# EAGLE design AST1013 (EAGLE 6.3)
DATABASE: ./../../../../../Components/TinyCircuits_Part_Database.txt
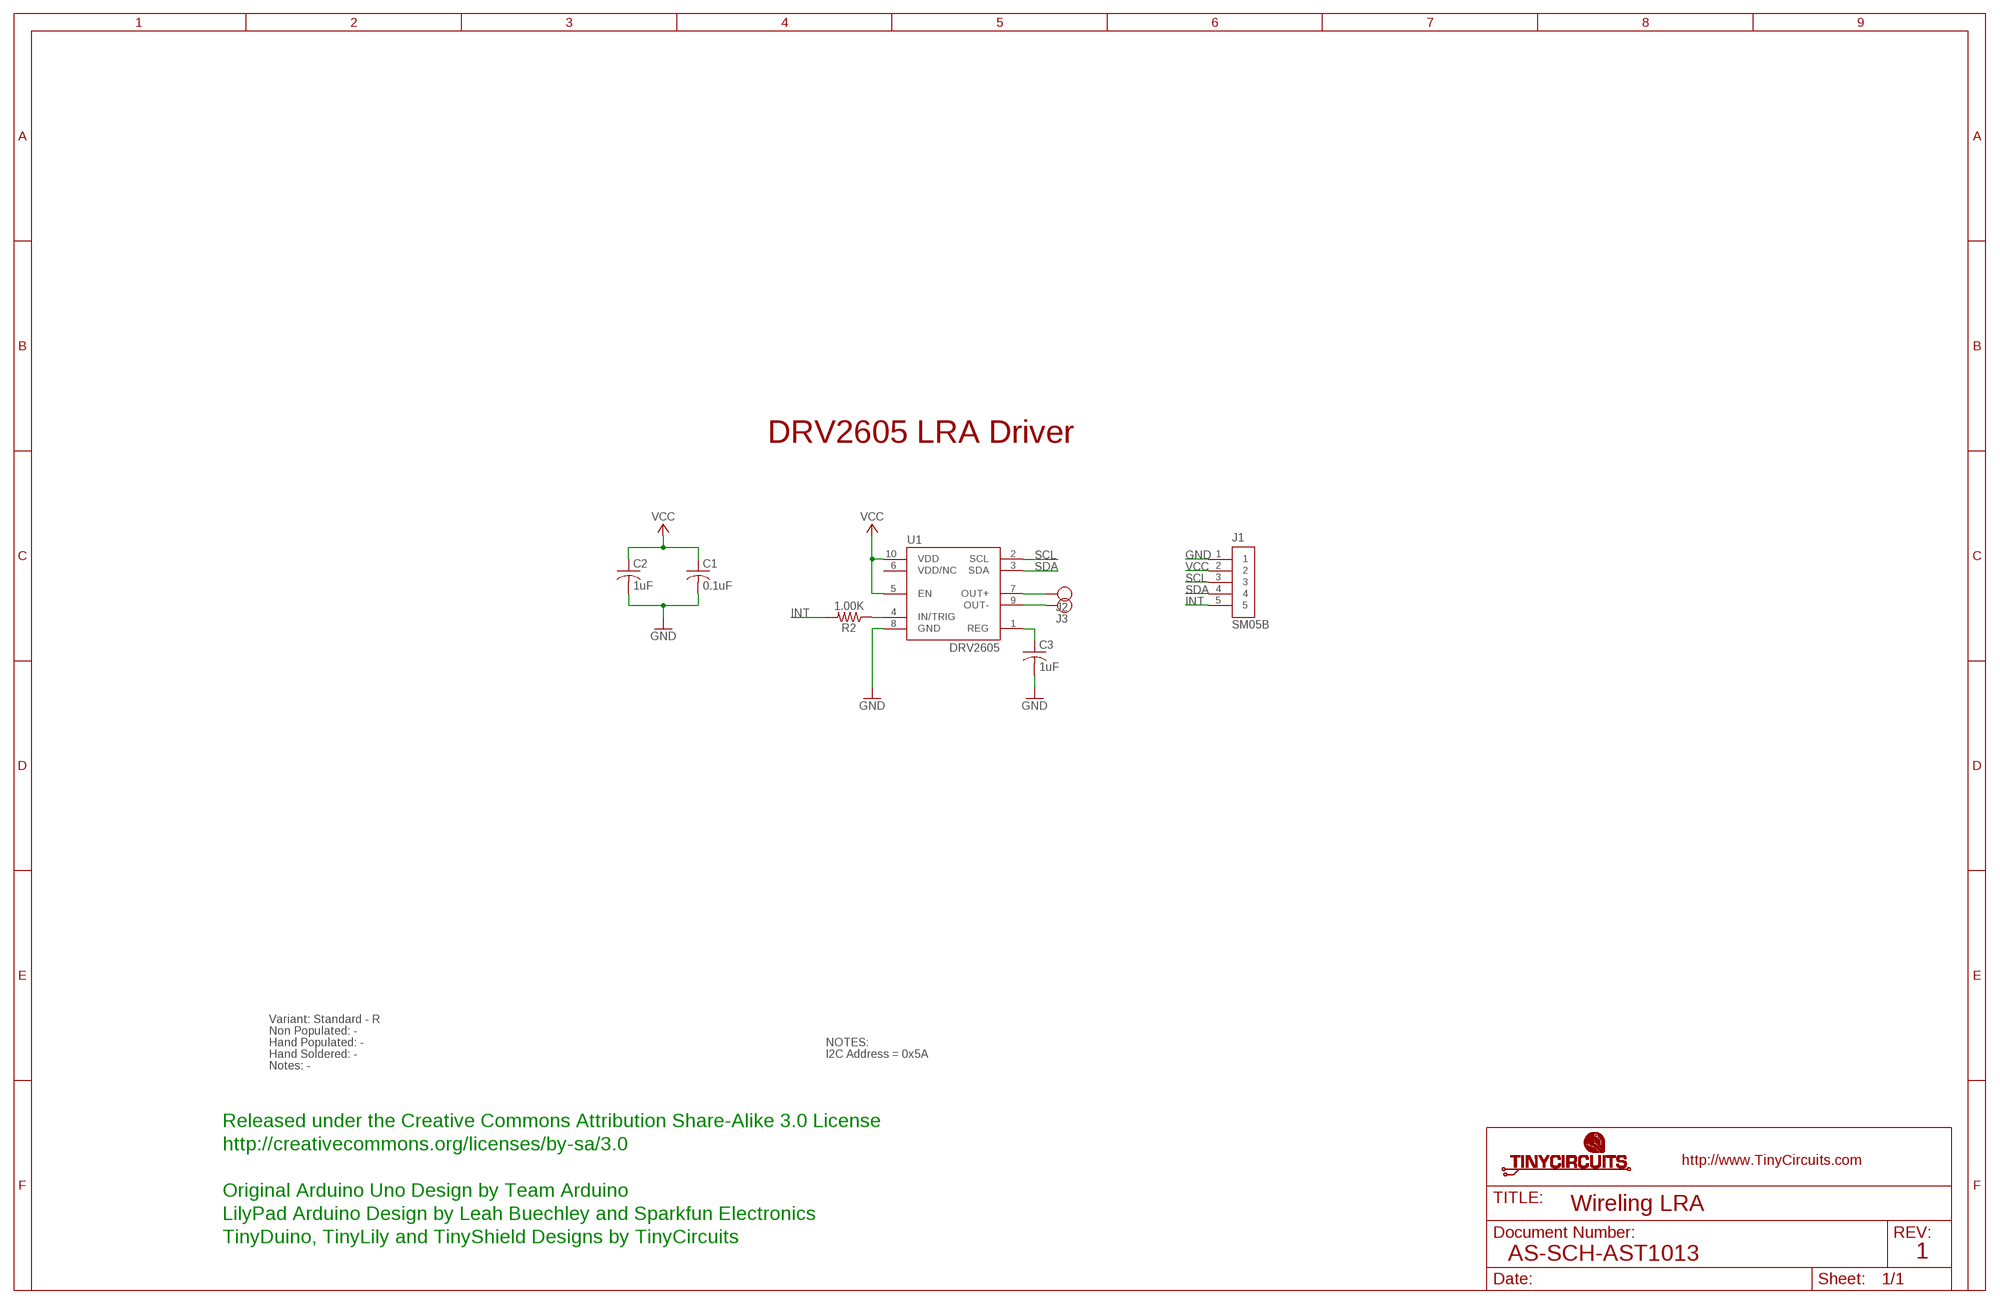
[diagram p0: schematic, sheet 1]

## Parts
C1  0.1uF  AS-ITM-00008  [C0402]
C2  1uF  AS-ITM-00410  [C0603]
C3  1uF  AS-ITM-00105  [C0402]
J1  SM05B  AS-ITM-00340  [JST_SH_5X1]
J2  PIN_1X.1"1  [1X.1"_2]
J3  PIN_1X.1"1  [1X.1"_2]
R2  1.00K  AS-ITM-00003  [0402]
U1  DRV2605  AS-ITM-00368  [DGS(S-PDSO-G10)]

## Nets
GND: C1.2 C2.2 C3.2 J1.1 U1.8(GND)
INT: J1.5 R2.2
N$1: J2.1 U1.7(OUT+)
N$2: J3.1 U1.9(OUT-)
N$3: C3.1 U1.1(REG)
N$6: R2.1 U1.4(IN/TRIG)
SCL: J1.3 U1.2(SCL)
SDA: J1.4 U1.3(SDA)
VCC: C1.1 C2.1 J1.2 U1.5(EN) U1.10(VDD)
Unconnected: U1.6(VDD/NC)

## Notes on the sheet
- DRV2605 LRA Driver
- Variant: Standard - R
- Non Populated: -
- Hand Populated: - | NOTES:
- Hand Soldered: - | I2C Address = 0x5A
- Notes: -
- Released under the Creative Commons Attribution Share-Alike 3.0 License
- http://creativecommons.org/licenses/by-sa/3.0
- Original Arduino Uno Design by Team Arduino
- Wireling LRA
- LilyPad Arduino Design by Leah Buechley and Sparkfun Electronics
- TinyDuino, TinyLily and TinyShield Designs by TinyCircuits
- AS-SCH-AST1013 | 1

## Library data of the parts
C1 = tinycircuits:AS-ITM-00008: CAP CER 0.1UF 16V 10% X5R 0402; PARTNO: AS-ITM-00008
C2 = tinycircuits:AS-ITM-00410: CAP CER 1UF 10V X5R 0603; PARTNO: AS-ITM-00410
C3 = tinycircuits:AS-ITM-00105: CAP CER 1UF 6.3V 10% X5R 0402; PARTNO: AS-ITM-00105
J1 = tinycircuits:AS-ITM-00340: CONN HEADER SH 5POS SIDE 1MM TIN; PARTNO: AS-ITM-00340; PNPROTATION: 180
J2 J3 = tinycircuits:PIN_1X.1": 1 Pin 0.100" Header
R2 = tinycircuits:AS-ITM-00003: RES 1.00K OHM 1/16W 1% 0402; PARTNO: AS-ITM-00003
U1 = tinycircuits:AS-ITM-00368: NEXT GEN DRV260X LRA/ERM DRIVER http://www.ti.com/lit/ds/symlink/drv2605l.pdf; PARTNO: AS-ITM-00368

## Net classes
2 gnd: width 0.305 mm, drill 0.559 mm, clearance 0.254 mm

## Board
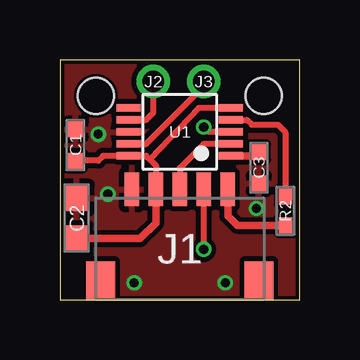
[diagram p1: board, top side]
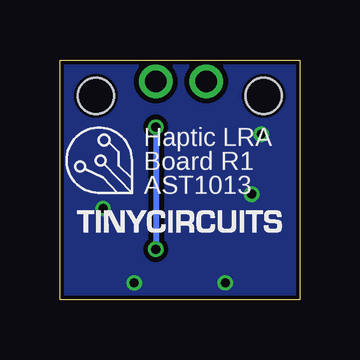
[diagram p2: board, bottom side, seen from below]

Size 10 x 10 mm. Coordinates in mm from the lower left corner, seen from the top.
Outline: 0,0 10,0 10,10 0,10 0,0
Copper layers (1*16): Top 0.035mm / dielectric 1.5mm / Bottom 0.035mm
Design rules "default *": minimum track width 8mil, minimum drill 15mil, track to track 8mil, track to pad 8mil, pad to pad 8mil, via to via 8mil, smd to smd 8mil, copper to edge 6mil, drill to drill 8mil, minimum pad ring 8mil, minimum via ring 5mil, stop-mask expansion 4mil, vias tented up to drill 25mil, thermal gap 10mil
Holes 1.5 mm at 1.5,8.5 8.5,8.5

### Footprints (pad centres in the part's own frame; a part is rotated, then mirrored left to right if it is on the bottom)
C0402 = smd 0.65 x 0.6: 1 -0.65,0; 2 0.65,0
C0603 = smd 1.1 x 1: 1 -0.85,0; 2 0.85,0
JST_SH_5X1 = smd 0.6 x 1.4: 1 -2,2.475; 2 -1,2.475; 3 0,2.475; 4 1,2.475; 5 2,2.475 | smd 1.2 x 1.6: PAD1 -3.3,-1.325; PAD2 3.3,-1.325
1X.1"_2 = drill 0.889 pad 1.397: 1 0,0
0402 = smd 0.65 x 0.55: 1 -0.6,0; 2 0.6,0
DGS(S-PDSO-G10) = smd 0.3 x 1: 1 -1,-2.14; 2 -0.5,-2.14; 3 0,-2.14; 4 0.5,-2.14; 5 1,-2.14; 6 1,2.14; 7 0.5,2.14; 8 0,2.14; 9 -0.5,2.14; 10 -1,2.14

### Placement (x,y rotation side)
C1  0.65,6.45 90 top
C2  0.7,3.4 90 top
C3  8.3,5.5 270 top
J1  5,2.12 0 top
J2  3.9,9.1 0 top
J3  6,9.1 0 top
R2  9.4,3.7 270 top
U1  5,7 90 top
U$1  [DOCFIELD-TINYCIRCUITS-PCB]  19,-10 0 top  (outside the outline)

### Tracks (layer width: path | path; a pad name or v marks a point on that pad's centre or on a via)
GND  (via drill 0.38)
  other vias: 3.1,0.7 6.9,0.7 2,4.4 1.6,6.9 8.2,3.8
  pour Bottom: 0,10 10,10 10,0 0,0
  pour Top: 0,10 10,10 10,0 0,0
INT
  Top 0.305: J1.5 7,3.5 7.4,3.1 R2.2
N$1
  Top 0.254: U1.7 3.6,7.5 3.9,7.8 J2.1
N$2
  Top 0.254: U1.9 3.6,6.5 5.7,8.6 5.7,8.8 J3.1
N$3
  Top 0.305: 8.15,6.2 C3.1 8.2,6 U1.1
N$6
  Top 0.254: U1.4 7.8,7.5 8,7.3 9.1,7.3 9.4,7 R2.1
SCL
  Top 0.254: U1.2 6,6.5 5,5.5 J1.3
SDA  (via drill 0.38)
  Top 0.254: v6,2.1 J1.4 | U1.3 6.2,7 v6,7.2
  Bottom 0.254: v6,7.2 v6,2.1
VCC
  Top 0.254: U1.5 5.8,8 3.75,5.85 | 3.75,5.85 3.6,6 U1.10 1.8,6 1.6,5.8 C1.1 | 3.75,5.85 4,5.6 J1.2
  Top 0.305: C2.1 3.35,2.55 4,3.2 J1.2

### Text on the board
bPlace: Haptic LRA | Board R1 | AST1013
Document: FABRICATION DRAWING | NOTES: | 1. PRINTED CIRCUIT BOARD MADE FROM NEMA GRADE FR-4 EPOXY LAMINATE | WITH 1 OUNCE COPPER PLATING AND .024 THICKNESS. | 2. ALL DIMENSIONS ARE GIVEN IN MILLIMETERS. | 3. CIRCUIT PATHS ARE FOR REFERENCE ONLY. | 4. HOLE SIZES SHOWN ARE FINISHED DIAMETERS AFTER PLATING. | 5. BOARD PLATED USING REFLOW OR SIMILAR METHOD. | 6. BOARD TO HAVE BLUE SOLDER MASK ON PLATED SURFACES USING WET FILM | 7. SILKSCREEN BOARD USING WHITE INK. | SR100 OR SR1010 EPOXY. EQUIVALENT WET OR DRY FILM MAY BE USED. | 8. THE FOLLOWING INFORMATION APPLIES TO THIS BOARD: | * 2 COPPER LAYERS | * .024 BOARD THICKNESS | * REQUIRES TOP SIDE SILKSCREEN | Released under the Creative Commons Attribution Share-Alike 3.0 License | http://creativecommons.org/licenses/by-sa/3.0 | Original Arduino Uno Design by Team Arduino | LilyPad Arduino Design by Leah Buechley and Sparkfun Electronics | TinyDuino, TinyLily and TinyShield Designs by TinyCircuits | Wireling LRA | AS-PCB-AST1013 | 1